# EAGLE design pure_battery (EAGLE 9.5.2)
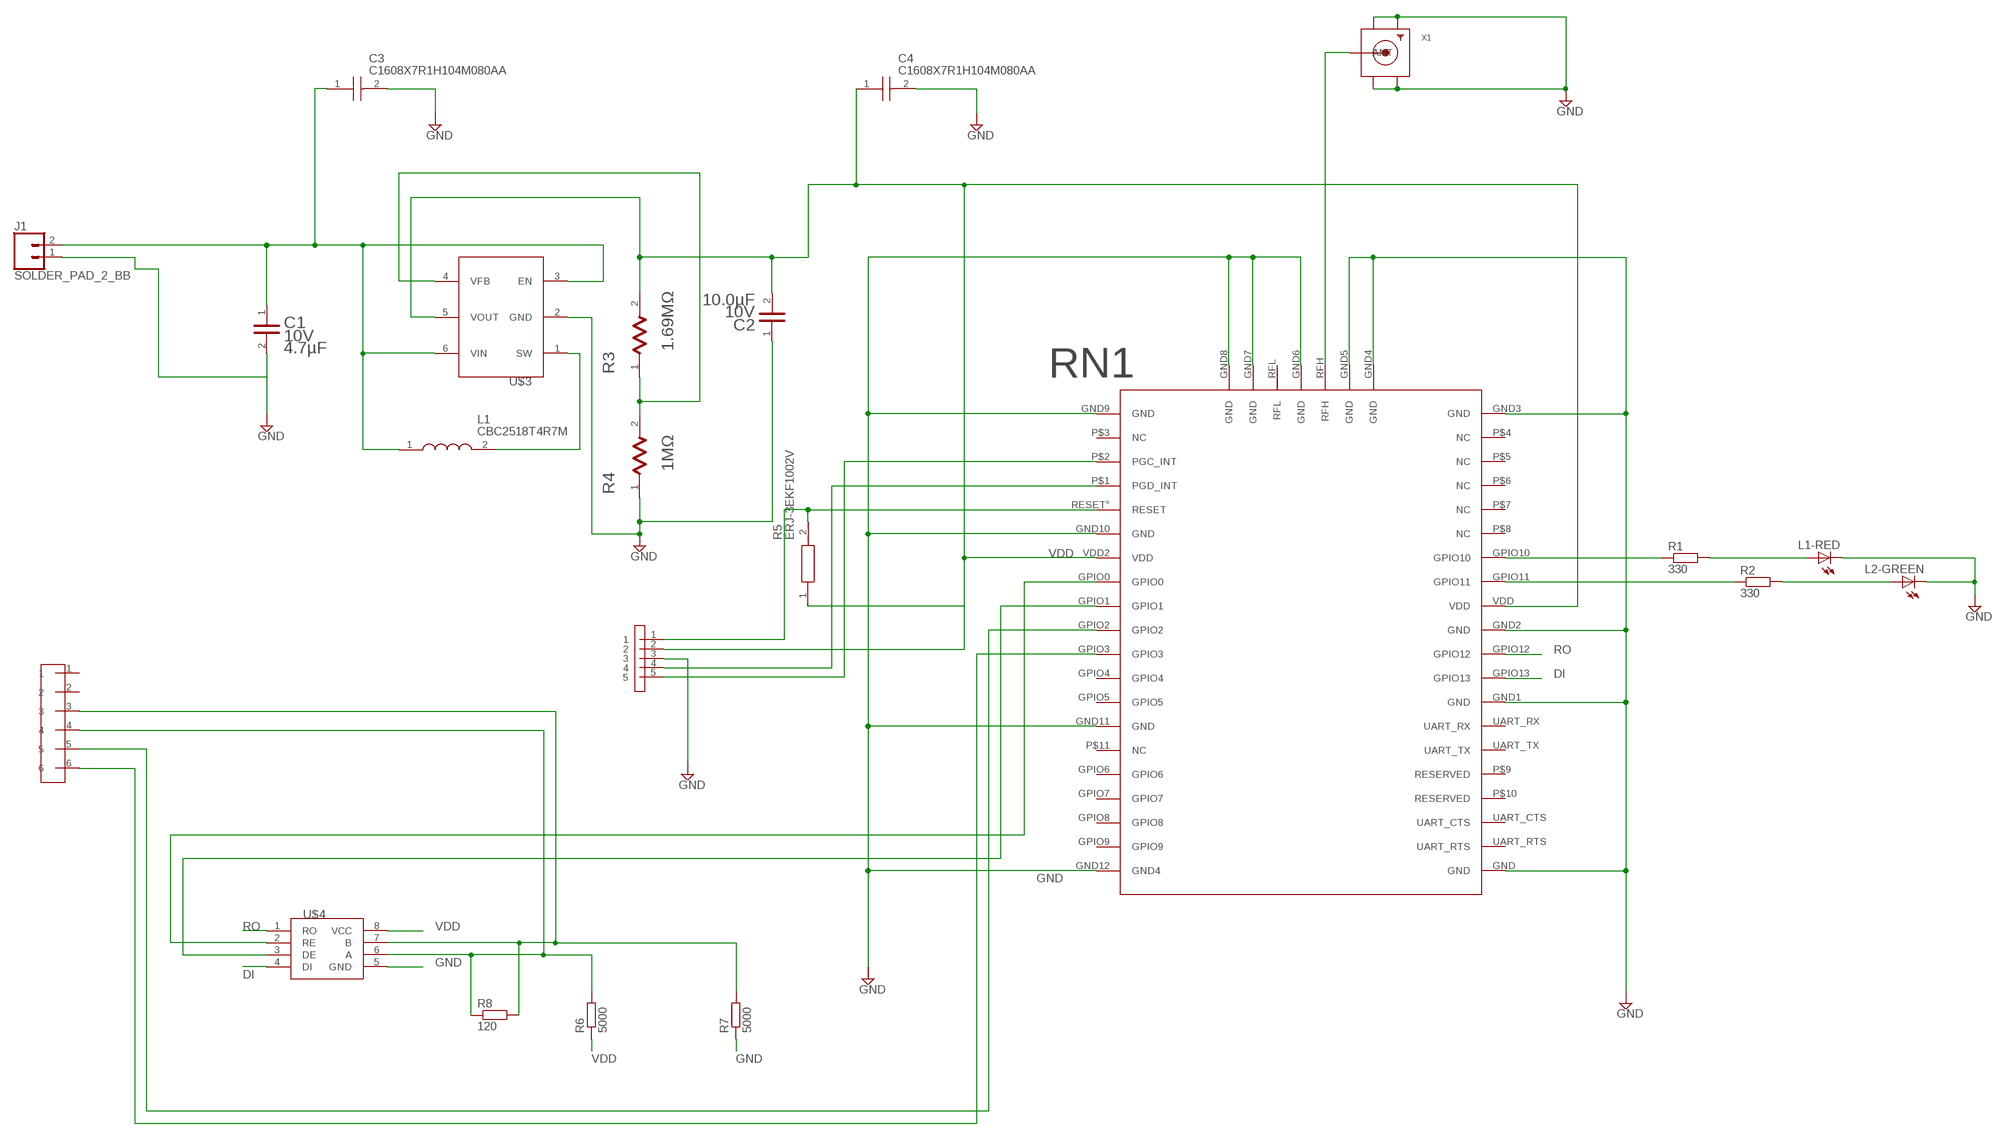
[diagram p0: schematic, sheet 1]

## Parts
C1  KEMET_C0603C475K8PACTUKEMET_C0603C475K8PACTU_0_0  [KEMET_C0603C475K8PACTU_0]
C2  TDK_C1608X5R1A106M080ACTDK_C1608X5R1A106M080AC_0_0  [TDK_C1608X5R1A106M080AC_0]
C3  C1608X7R1H104M080AA  [CAPC1608X80N]
C4  C1608X7R1H104M080AA  [CAPC1608X80N]
J1  SOLDER_PAD_2_BB  [SOLDER_PAD_2]
L1  CBC2518T4R7M  [INDC2518X200N]
L1-RED  LEDCHIP-LED0603  [CHIP-LED0603]
L2-GREEN  LEDCHIP-LED0603  [CHIP-LED0603]
R1  330  R-EU_R0603  [R0603]
R2  330  R-EU_R0603  [R0603]
R3  VISHAY_CRCW06031M69FKEAVISHAY_CRCW06031M69FKEA_0_1  [VISHAY_CRCW06031M69FKEA_1]
R4  STACKPOLE_RMCF0603FT1M00STACKPOLE_RMCF0603FT1M00_0_1  [STACKPOLE_RMCF0603FT1M00_1]
R5  ERJ-3EKF1002V  [RESC1608X55N]
R6  5000  R-EU_R0805  [R0805]
R7  5000  R-EU_R0805  [R0805]
R8  120  R-EU_R0805  [R0805]
RN1  NEW_RN2483  [NEW_RN2483]
U$1  CONNECTOR62  [CONNECTOR6]
U$2  ICSP52  [ICSP]
U$3  MCP16252  [MCP16252]
U$4  AMD3485E  [AMD3485E]
X1  SMACONNECTOR_EDGE  [SMA_EDGELAUNCH]

## Nets
DI: RN1.GPIO13 U$4.4(DI)
GND: C1.2 C2.1 C3.2 C4.2 J1.1 L1-RED.C L2-GREEN.C R4.1 R7.1 RN1.GND RN1.GND1(GND) RN1.GND2(GND) RN1.GND3(GND) RN1.GND4(GND) RN1.GND5(GND) RN1.GND6(GND) RN1.GND7(GND) RN1.GND8(GND) RN1.GND9(GND) RN1.GND10(GND) RN1.GND11(GND) RN1.GND12(GND4) U$2.3 U$3.2(GND) U$4.5(GND) X1.GND@1(GND4) X1.GND@2(GND3) X1.GND@3(GND2) X1.GND@4(GND1)
N$1: R1.1 RN1.GPIO10
N$2: L1-RED.A R1.2
N$3: C1.1 C3.1 J1.2 L1.1 U$3.3(EN) U$3.6(VIN)
N$4: R2.1 RN1.GPIO11
N$5: L2-GREEN.A R2.2
N$6: RN1.P$2(PGC_INT) U$2.5
N$7: L1.2 U$3.1(SW)
N$8: R3.1 R4.2 U$3.4(VFB)
N$9: RN1.P$1(PGD_INT) U$2.4
N$10: RN1.GPIO0 U$4.2(RE)
N$11: R5.2 RN1.RESET°(RESET) U$2.1
N$12: RN1.RFH X1.P(ANT)
N$13: R7.2 R8.2 U$1.3 U$4.7(B)
N$14: R6.2 R8.1 U$1.4 U$4.6(A)
N$15: RN1.GPIO1 U$4.3(DE)
N$16: RN1.GPIO2 U$1.5
N$17: RN1.GPIO3 U$1.6
RO: RN1.GPIO12 U$4.1(RO)
VDD: C2.2 C4.1 R3.2 R5.1 R6.1 RN1.VDD RN1.VDD2(VDD) U$2.2 U$3.5(VOUT) U$4.8(VCC)
Unconnected: RN1.GPIO4 RN1.GPIO5 RN1.GPIO6 RN1.GPIO7 RN1.GPIO8 RN1.GPIO9 RN1.P$3(NC) RN1.P$4(NC) RN1.P$5(NC) RN1.P$6(NC) RN1.P$7(NC) RN1.P$8(NC) RN1.P$9(RESERVED) RN1.P$10(RESERVED) RN1.P$11(NC) RN1.RFL RN1.UART_CTS RN1.UART_RTS RN1.UART_RX RN1.UART_TX U$1.1 U$1.2

## Library data of the parts
C1 = Kemet - C0603C475K8PACTU:KEMET_C0603C475K8PACTU: CAP CER 4.7UF 10V X5R 0603; CAPACITANCE: 4.7µF; CENTROID_NOT_SPECIFIED: No; DATASHEET: https://search.kemet.com/component-edge/download/datasheet/C0603C475K8PACTU.pdf; DIGIKEY_DESCRIPTION: CAP CER 4.7UF 10V X5R 0603; DIGIKEY_PART_NUMBER: 399-5503-1-ND; LEAD_FREE: yes; MF: Kemet; MFG_PACKAGE_IDENT: C0603; MOUSER_DESCRIPTION: Multilayer Ceramic Capacitors MLCC - SMD/SMT 10volts 4.7uF 10% X5R; MOUSER_PART_NUMBER: 80-C0603C475K8P; MPN: C0603C475K8PACTU; PACKAGE: 0603; PREFIX: C; ROHS: yes; TEMPERATURE_RANGE_HIGH: +85°C; TEMPERATURE_RANGE_LOW: -55°C; VOLTAGE: 10V
C2 = TDK - C1608X5R1A106M080AC:TDK_C1608X5R1A106M080AC: 10 uF Ceramic Capacitor; CAPACITANCE: 10.0µF; CAPACITANCE_TOLERANCE: ±20%; CENTROID_NOT_SPECIFIED: No; DATASHEET: https://product.tdk.com/info/en/catalog/datasheets/mlcc_commercial_general_en.pdf; DIELECTRIC_CHARACTERISTIC: X5R; DIELECTRIC_MATERIAL: Ceramic Multilayer; DIGIKEY_DESCRIPTION: CAP CER 10UF 10V X5R 0603; DIGIKEY_PART_NUMBER: 445-6853-1-ND; IMPORTED_FROM: octopart; IPC_LAND_PATTERN_NAME: CAPC16080X80; LEAD_FREE: yes; MF: TDK; MOUSER_PART_NUMBER: 810-C1608X5R1A106M; MPN: C1608X5R1A106M080AC; NUM_PINS: 2; OCTOPART_PART_NUMBER: f5f73d6e4e4d2a30; PACKAGE: 0603; PREFIX: C; ROHS: yes; SIZE_LENGTH: 1.6 mm; SIZE_THICKNESS: 800 um; SIZE_WIDTH: 800 um; TEMPERATURE_RANGE_HIGH: +85°C; TEMPERATURE_RANGE_LOW: -55°C; VOLTAGE: 10V; VOLTAGE_RATING_DC: 10 V
C3 C4 = C1608X7R1H104M080AA:C1608X7R1H104M080AA: TDK 0603 C 100nF Ceramic Multilayer Capacitor, 50 V dc, +125C, X7R Dielectric, +/-20% Source: Datasheet <https://product.tdk.com/info/en/catalog/datasheets/mlcc_commercial_midvoltage_en.pdf>; ARROW_PART_NUMBER: C1608X7R1H104M080AA; ARROW_PRICE-STOCK: https://www.arrow.com/en/products/c1608x7r1h104m080aa/tdk; DESCRIPTION: TDK 0603 C 100nF Ceramic Multilayer Capacitor, 50 V dc, +125C, X7R Dielectric, +/-20%; HEIGHT: 0.8mm; MANUFACTURER_NAME: TDK; MANUFACTURER_PART_NUMBER: C1608X7R1H104M080AA; MOUSER_PART_NUMBER: 810-C1608X7R1H104M; MOUSER_PRICE-STOCK: https://www.mouser.co.uk/ProductDetail/TDK/C1608X7R1H104M080AA?qs=dfay7wIA1uEL2BE%2FFUaTdg%3D%3D
J1 = SparkFun-Connectors:SOLDER_PAD_2_BB: Solder Pad for LuMini Rings
L1 = CBC2518T4R7M:CBC2518T4R7M: Fixed Inductors INDCTR HI CUR WND 1007 4.7uH 20% Source: Datasheet <http://ds.yuden.co.jp/TYCOMPAS/ut/detail.do?productNo=CBC2518T4R7M&dataUnit=M.pdf>; ARROW_PART_NUMBER: CBC2518T4R7M; DESCRIPTION: Fixed Inductors INDCTR HI CUR WND 1007 4.7uH 20%; HEIGHT: 2mm; MANUFACTURER_NAME: TAIYO YUDEN; MANUFACTURER_PART_NUMBER: CBC2518T4R7M; MOUSER_PART_NUMBER: 963-CBC2518T4R7M; MOUSER_PRICE-STOCK: https://www.mouser.com/Search/Refine.aspx?Keyword=963-CBC2518T4R7M
L1-RED L2-GREEN = adafruit:LED: LED OSRAM: - CHIPLED LG R971, LG N971, LY N971, LG Q971, LY Q971, LO R971, LY R971 LH N974, LH R974 LS Q976, LO Q976, LY Q976 LO Q996 - Hyper CHIPLED LW Q18S LB Q993, LB Q99A, LB R99A - SideLED LS A670, LO A670, LY A670, LG A670, LP A670 LB A673, LV A673, LT A673, LW A673 LH A674 LY A675 LS A676, LA A676, LO A676, LY A676, LW A676 LS A679, LY A679, LG A679 - Hyper Micro SIDELED® LS Y876, LA Y876, LO Y876, LY Y876 LT Y87S - SmartLED LW L88C, LW L88S LB L89C, LB L89S, LG L890 LS L89K, LO L89K, LY L89K LS L896, LA L896, LO L896, LY L896 - TOPLED LS T670, LO T670, LY T670, LG T670, LP T670 LSG T670, LSP T670, LSY T670, LOP T670, LYG T670 LG T671, LOG T671, LSG T671 LB T673, LV T673, LT T673, LW T673 LH T674 LS T676, LA T676, LO T676, LY T676, LB T676, LH T676, LSB T676, LW T676 LB T67C, LV T67C, LT T67C, LS T67K, LO T67K, LY T67K, LW E67C LS E67B, LA E67B, LO E67B, LY E67B, LB E67C, LV E67C, LT E67C LW T67C LS T679, LY T679, LG T679 LS T770, LO T770, LY T770, LG T770, LP T770 LB T773, LV T773, LT T773, LW T773 LH T774 LS E675, LA E675, LY E675, LS T675 LS T776, LA T776, LO T776, LY T776, LB T776 LHGB T686 LT T68C, LB T68C - Hyper Mini TOPLED® LB M676 - Mini TOPLED Santana® LG M470 LS M47K, LO M47K, LY M47K Source: http://www.osram.convergy.de/
R1 R2 R6-R8 = rcl:R-EU_: RESISTOR, European symbol; SPICEPREFIX: R
R3 = Vishay - CRCW06031M69FKEA:VISHAY_CRCW06031M69FKEA: RES Thick Film SMD 1.69MΩ 1% 1/10W 0603 100ppm/K; APPROVED_ALTERNATE_PART_NUMBER: 541-1.00HHCT-ND; CENTROID_NOT_SPECIFIED: No; COMPOSITION: Thick Film; DATASHEET: https://www.vishay.com/docs/20035/dcrcwe3.pdf; DEVICE_CLASS_L1: Passive Components; DEVICE_CLASS_L2: Resistors; DEVICE_CLASS_L3: Chip SMD Resistors; DIGIKEY_DESCRIPTION: RES SMD 1.69M OHM 1% 1/10W 0603; DIGIKEY_PART_NUMBER: 541-1.69MHTR-ND; FOOTPRINT_PARAMETERS_0: {"fp_type":"chip_res","params":{"L":{"nom":1550000,"long name":"Length","min":1500000,"max":1650000,"short name":"L","type":"measurement"},"W":{"nom":850000,"long name":"Width","min":750000,"max":950000,"short name":"W","type":"measurement"},"t":{"nom":450000,"long name":"Height","min":400000,"max":500000,"short name":"t","type":"measurement"},"b":{"nom":300000,"long name":"Terminal width","min":100000,"max":500000,"short name":"b","type":"measurement"},"P":{"default":"false","long name":"Polarized","type":"multichoice","short name":"P"},"offset x":{"nom":0,"long name":"X Center offset","min":null,"max":null,"short name":"offset x","type":"measurement"},"offset y":{"nom":0,"long name":"Y Center offset","min":null,"max":null,"short name":"offset y","type":"measurement"},"LS":{"long name":"Land shape","type":"fixed","short name":"LS","value":"Rectangle"},"solder toe":{"nom":550000,"long name":"Solder fillet (toe)","min":null,"max":null,"short name":"solder toe","type":"fixedmeasurement"},"solder heel":{"nom":-50000,"long name":"Solder fillet (heel)","min":null,"max":null,"short name":"solder heel","type":"fixedmeasurement"},"solder side":{"nom":50000,"long name":"Solder fillet (side)","min":null,"max":null,"short name":"solder side","type":"fixedmeasurement"},"courtyard":{"nom":500000,"long name":"Courtyard","min":null,"max":null,"short name":"courtyard","type":"fixedmeasurement"},"SF":{"default":"A (>= 1608 metric)","long name":"Packing level","type":"multichoiceparent","short name":"SF","help":"http://support.upverter.com/customer/portal/articles/978783-what-is-a-footprint-packing-level","children":["solder toe","solder heel","solder side","courtyard"]}}}; FOOTPRINT_PARAMETERS_1: {"fp_type":"chip_res","params":{"L":{"nom":1550000,"long name":"Length","min":1500000,"max":1650000,"short name":"L","type":"measurement"},"W":{"nom":850000,"long name":"Width","min":750000,"max":950000,"short name":"W","type":"measurement"},"t":{"nom":450000,"long name":"Height","min":400000,"max":500000,"short name":"t","type":"measurement"},"b":{"nom":300000,"long name":"Terminal width","min":100000,"max":500000,"short name":"b","type":"measurement"},"P":{"default":"false","long name":"Polarized","type":"multichoice","short name":"P"},"offset x":{"nom":0,"long name":"X Center offset","min":null,"max":null,"short name":"offset x","type":"measurement"},"offset y":{"nom":0,"long name":"Y Center offset","min":null,"max":null,"short name":"offset y","type":"measurement"},"LS":{"long name":"Land shape","type":"fixed","short name":"LS","value":"Rectangle"},"solder toe":{"nom":350000,"long name":"Solder fillet (toe)","min":null,"max":null,"short name":"solder toe","type":"fixedmeasurement"},"solder heel":{"nom":-50000,"long name":"Solder fillet (heel)","min":null,"max":null,"short name":"solder heel","type":"fixedmeasurement"},"solder side":{"nom":0,"long name":"Solder fillet (side)","min":null,"max":null,"short name":"solder side","type":"fixedmeasurement"},"courtyard":{"nom":250000,"long name":"Courtyard","min":null,"max":null,"short name":"courtyard","type":"fixedmeasurement"},"SF":{"default":"B (>= 1608 metric)","long name":"Packing level","type":"multichoiceparent","short name":"SF","help":"http://support.upverter.com/customer/portal/articles/978783-what-is-a-footprint-packing-level","children":["solder toe","solder heel","solder side","courtyard"]}}}; FOOTPRINT_PARAMETERS_2: {"fp_type":"chip_res","params":{"L":{"nom":1550000,"long name":"Length","min":1500000,"max":1650000,"short name":"L","type":"measurement"},"W":{"nom":850000,"long name":"Width","min":750000,"max":950000,"short name":"W","type":"measurement"},"t":{"nom":450000,"long name":"Height","min":400000,"max":500000,"short name":"t","type":"measurement"},"b":{"nom":300000,"long name":"Terminal width","min":100000,"max":500000,"short name":"b","type":"measurement"},"P":{"default":"false","long name":"Polarized","type":"multichoice","short name":"P"},"offset x":{"nom":0,"long name":"X Center offset","min":null,"max":null,"short name":"offset x","type":"measurement"},"offset y":{"nom":0,"long name":"Y Center offset","min":null,"max":null,"short name":"offset y","type":"measurement"},"LS":{"long name":"Land shape","type":"fixed","short name":"LS","value":"Rectangle"},"solder toe":{"nom":150000,"long name":"Solder fillet (toe)","min":null,"max":null,"short name":"solder toe","type":"fixedmeasurement"},"solder heel":{"nom":-50000,"long name":"Solder fillet (heel)","min":null,"max":null,"short name":"solder heel","type":"fixedmeasurement"},"solder side":{"nom":-50000,"long name":"Solder fillet (side)","min":null,"max":null,"short name":"solder side","type":"fixedmeasurement"},"courtyard":{"nom":100000,"long name":"Courtyard","min":null,"max":null,"short name":"courtyard","type":"fixedmeasurement"},"SF":{"default":"C (>= 1608 metric)","long name":"Packing level","type":"multichoiceparent","short name":"SF","help":"http://support.upverter.com/customer/portal/articles/978783-what-is-a-footprint-packing-level","children":["solder toe","solder heel","solder side","courtyard"]}}}; FOOTPRINT_VARIANT_NAME_0: IPC_A; FOOTPRINT_VARIANT_NAME_1: IPC_B; FOOTPRINT_VARIANT_NAME_2: IPC_C; FOOTPRINT_VARIANT_NAME_3: Recommended_Land_Pattern; HEIGHT: 0.5mm; IPC_LAND_PATTERN_NAME: RESC15585X45; LEAD_FREE: yes; MF: Vishay; MFG_PACKAGE_IDENT: CRCW0603; MFG_PACKAGE_IDENT_DATE: 0; MFG_PACKAGE_IDENT_REV: 0; MOUSER_DESCRIPTION: Thick Film Resistors - SMD 1/10watt 1.69Mohms 1%; MOUSER_PART_NUMBER: 71-CRCW06031M69FKEA; MPN: CRCW06031M69FKEA; PACKAGE: 0603 (1608 Metric); POWER: 100mW; POWER_RATING: 0.1W; PREFIX: R; RESISTANCE: 1.69MΩ; ROHS: yes; SERIES: CRCW; STANDOFF_HEIGHT: 0mm; TEMPERATURE_COEFFICIENT: 100ppm/K; TEMPERATURE_RANGE_HIGH: +155°C; TEMPERATURE_RANGE_LOW: -55°C; TOLERANCE: 1%; VERIFICATION_VERSION: 0.0.0.1; VOLTAGE: 75V; VOLTAGE_RATING: 75V
R4 = Stackpole - RMCF0603FT1M00:STACKPOLE_RMCF0603FT1M00: RES Thick Film SMD 1MΩ 1% 1/10W 0603 100ppm/°C; APPROVED_ALTERNATE_PART_NUMBER: 541-1.00HHCT-ND; CENTROID_NOT_SPECIFIED: No; COMPOSITION: Thick Film; DATASHEET: https://www.seielect.com/Catalog/SEI-RMCF_RMCP.pdf; DEVICE_CLASS_L1: Passive Components; DEVICE_CLASS_L2: Resistors; DEVICE_CLASS_L3: Chip SMD Resistors; DIGIKEY_DESCRIPTION: RES TF 1/10W 1M OHM 1% 0603; DIGIKEY_PART_NUMBER: RMCF0603FT1M00-ND; FOOTPRINT_PARAMETERS_0: {"fp_type":"chip_res","params":{"L":{"nom":1550000,"long name":"Length","min":1500000,"max":1650000,"short name":"L","type":"measurement"},"W":{"nom":850000,"long name":"Width","min":750000,"max":950000,"short name":"W","type":"measurement"},"t":{"nom":450000,"long name":"Height","min":400000,"max":500000,"short name":"t","type":"measurement"},"b":{"nom":300000,"long name":"Terminal width","min":100000,"max":500000,"short name":"b","type":"measurement"},"P":{"default":"false","long name":"Polarized","type":"multichoice","short name":"P"},"offset x":{"nom":0,"long name":"X Center offset","min":null,"max":null,"short name":"offset x","type":"measurement"},"offset y":{"nom":0,"long name":"Y Center offset","min":null,"max":null,"short name":"offset y","type":"measurement"},"LS":{"long name":"Land shape","type":"fixed","short name":"LS","value":"Rectangle"},"solder toe":{"nom":550000,"long name":"Solder fillet (toe)","min":null,"max":null,"short name":"solder toe","type":"fixedmeasurement"},"solder heel":{"nom":-50000,"long name":"Solder fillet (heel)","min":null,"max":null,"short name":"solder heel","type":"fixedmeasurement"},"solder side":{"nom":50000,"long name":"Solder fillet (side)","min":null,"max":null,"short name":"solder side","type":"fixedmeasurement"},"courtyard":{"nom":500000,"long name":"Courtyard","min":null,"max":null,"short name":"courtyard","type":"fixedmeasurement"},"SF":{"default":"A (>= 1608 metric)","long name":"Packing level","type":"multichoiceparent","short name":"SF","help":"http://support.upverter.com/customer/portal/articles/978783-what-is-a-footprint-packing-level","children":["solder toe","solder heel","solder side","courtyard"]}}}; FOOTPRINT_PARAMETERS_1: {"fp_type":"chip_res","params":{"L":{"nom":1550000,"long name":"Length","min":1500000,"max":1650000,"short name":"L","type":"measurement"},"W":{"nom":850000,"long name":"Width","min":750000,"max":950000,"short name":"W","type":"measurement"},"t":{"nom":450000,"long name":"Height","min":400000,"max":500000,"short name":"t","type":"measurement"},"b":{"nom":300000,"long name":"Terminal width","min":100000,"max":500000,"short name":"b","type":"measurement"},"P":{"default":"false","long name":"Polarized","type":"multichoice","short name":"P"},"offset x":{"nom":0,"long name":"X Center offset","min":null,"max":null,"short name":"offset x","type":"measurement"},"offset y":{"nom":0,"long name":"Y Center offset","min":null,"max":null,"short name":"offset y","type":"measurement"},"LS":{"long name":"Land shape","type":"fixed","short name":"LS","value":"Rectangle"},"solder toe":{"nom":350000,"long name":"Solder fillet (toe)","min":null,"max":null,"short name":"solder toe","type":"fixedmeasurement"},"solder heel":{"nom":-50000,"long name":"Solder fillet (heel)","min":null,"max":null,"short name":"solder heel","type":"fixedmeasurement"},"solder side":{"nom":0,"long name":"Solder fillet (side)","min":null,"max":null,"short name":"solder side","type":"fixedmeasurement"},"courtyard":{"nom":250000,"long name":"Courtyard","min":null,"max":null,"short name":"courtyard","type":"fixedmeasurement"},"SF":{"default":"B (>= 1608 metric)","long name":"Packing level","type":"multichoiceparent","short name":"SF","help":"http://support.upverter.com/customer/portal/articles/978783-what-is-a-footprint-packing-level","children":["solder toe","solder heel","solder side","courtyard"]}}}; FOOTPRINT_PARAMETERS_2: {"fp_type":"chip_res","params":{"L":{"nom":1550000,"long name":"Length","min":1500000,"max":1650000,"short name":"L","type":"measurement"},"W":{"nom":850000,"long name":"Width","min":750000,"max":950000,"short name":"W","type":"measurement"},"t":{"nom":450000,"long name":"Height","min":400000,"max":500000,"short name":"t","type":"measurement"},"b":{"nom":300000,"long name":"Terminal width","min":100000,"max":500000,"short name":"b","type":"measurement"},"P":{"default":"false","long name":"Polarized","type":"multichoice","short name":"P"},"offset x":{"nom":0,"long name":"X Center offset","min":null,"max":null,"short name":"offset x","type":"measurement"},"offset y":{"nom":0,"long name":"Y Center offset","min":null,"max":null,"short name":"offset y","type":"measurement"},"LS":{"long name":"Land shape","type":"fixed","short name":"LS","value":"Rectangle"},"solder toe":{"nom":150000,"long name":"Solder fillet (toe)","min":null,"max":null,"short name":"solder toe","type":"fixedmeasurement"},"solder heel":{"nom":-50000,"long name":"Solder fillet (heel)","min":null,"max":null,"short name":"solder heel","type":"fixedmeasurement"},"solder side":{"nom":-50000,"long name":"Solder fillet (side)","min":null,"max":null,"short name":"solder side","type":"fixedmeasurement"},"courtyard":{"nom":100000,"long name":"Courtyard","min":null,"max":null,"short name":"courtyard","type":"fixedmeasurement"},"SF":{"default":"C (>= 1608 metric)","long name":"Packing level","type":"multichoiceparent","short name":"SF","help":"http://support.upverter.com/customer/portal/articles/978783-what-is-a-footprint-packing-level","children":["solder toe","solder heel","solder side","courtyard"]}}}; FOOTPRINT_VARIANT_NAME_0: IPC_A; FOOTPRINT_VARIANT_NAME_1: IPC_B; FOOTPRINT_VARIANT_NAME_2: IPC_C; FOOTPRINT_VARIANT_NAME_3: Recommended_Land_Pattern; HEIGHT: 0.5mm; IPC_LAND_PATTERN_NAME: RESC15585X45; LEAD_FREE: yes; MF: Stackpole; MFG_PACKAGE_IDENT: RMCF0603; MFG_PACKAGE_IDENT_DATE: 0; MFG_PACKAGE_IDENT_REV: 0; MPN: RMCF0603FT1M00; PACKAGE: 0603 (1608 Metric); POWER: 100mW; POWER_RATING: 0.1W; PREFIX: R; RESISTANCE: 1MΩ; ROHS: yes; SERIES: RMCF; STANDOFF_HEIGHT: 0mm; TEMPERATURE_COEFFICIENT: 100ppm/°C; TEMPERATURE_RANGE_HIGH: +155°C; TEMPERATURE_RANGE_LOW: -55°C; TOLERANCE: 1%; VERIFICATION_VERSION: 0.0.0.1; VOLTAGE: 75V; VOLTAGE_RATING: 75V
R5 = ERJ-3EKF1002V:ERJ-3EKF1002V: Thick Film Resistors - SMD 0603 10Kohms 1% AEC-Q200 Source: Datasheet <http://industrial.panasonic.com/cdbs/www-data/pdf/RDA0000/AOA0000C86.pdf>; ARROW_PART_NUMBER: ERJ-3EKF1002V; ARROW_PRICE-STOCK: https://www.arrow.com/en/products/erj-3ekf1002v/panasonic; DESCRIPTION: Thick Film Resistors - SMD 0603 10Kohms 1% AEC-Q200; HEIGHT: 0.55mm; MANUFACTURER_NAME: Panasonic; MANUFACTURER_PART_NUMBER: ERJ-3EKF1002V; MOUSER_PART_NUMBER: 667-ERJ-3EKF1002V; MOUSER_PRICE-STOCK: https://www.mouser.co.uk/ProductDetail/Panasonic/ERJ-3EKF1002V?qs=H7k1u0Mp9JSrGPQ5%2F5COuw%3D%3D
RN1 = tobias:NEW_RN2483
U$1 = conn4:CONNECTOR62
U$2 = conn4:ICSP52
U$3 = my_library:MCP16252
U$4 = AMD3485E:AMD3485E
X1 = adafruit:SMACONNECTOR: SMA Connector 90° DIP SMA Connector, 50 Ohm (4UConnector: 07259)

## Board
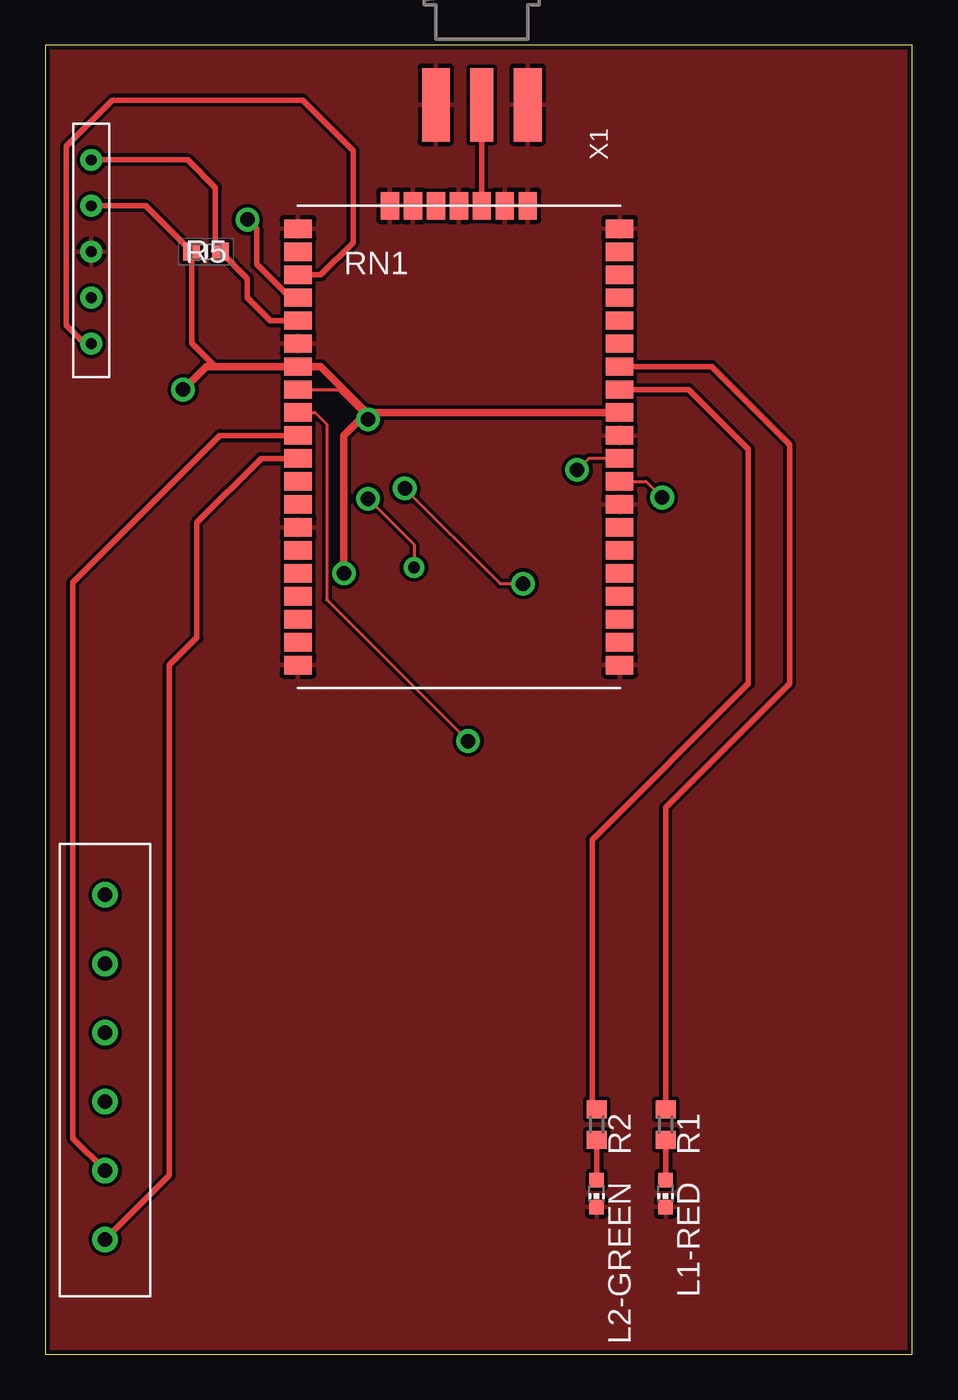
[diagram p1: board, top side]
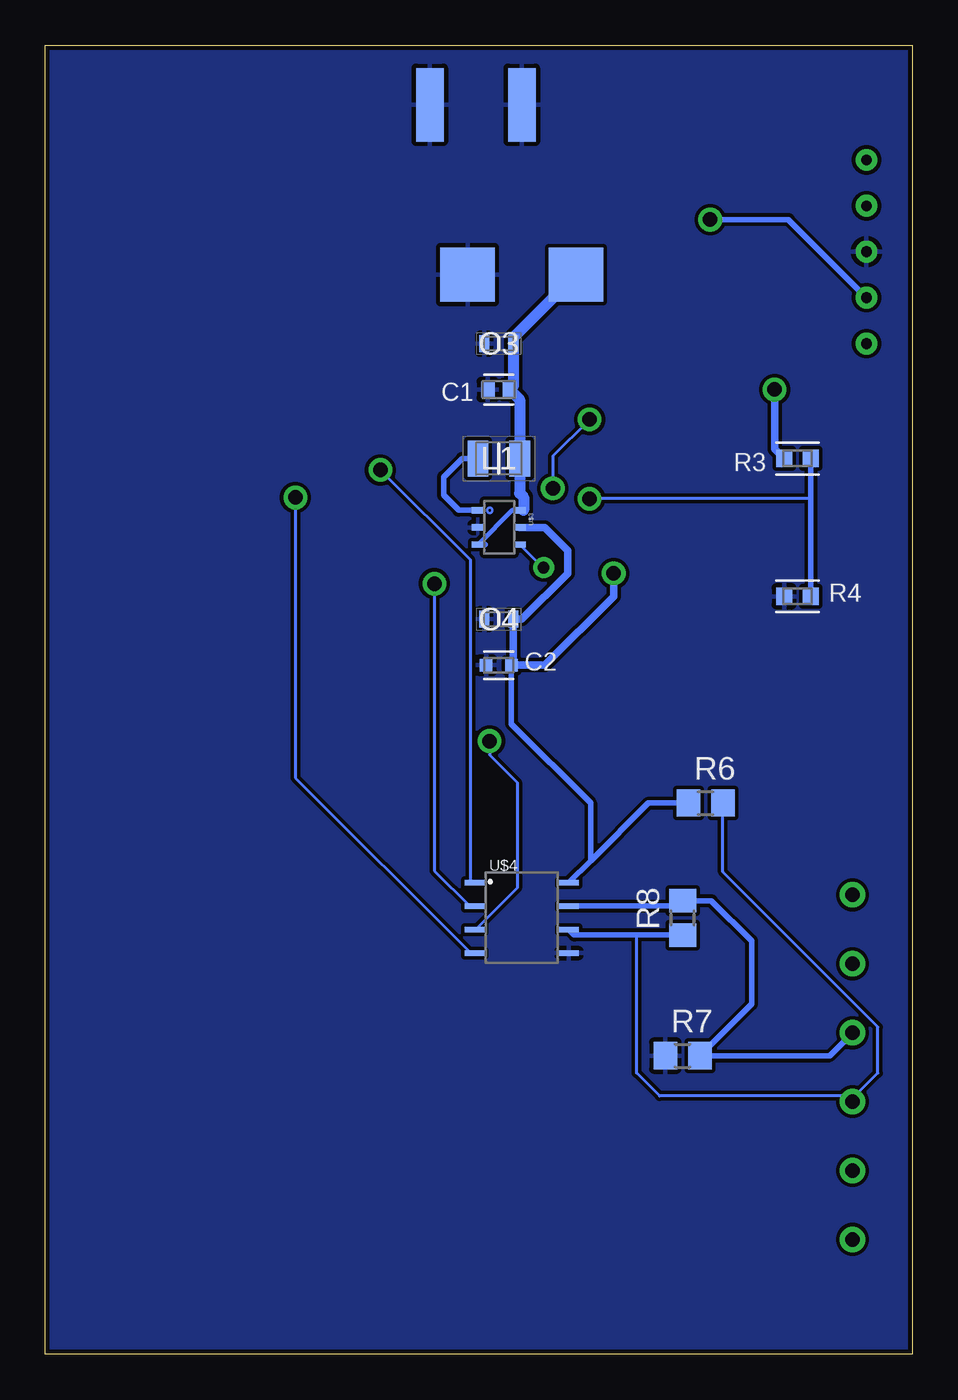
[diagram p2: board, bottom side, seen from below]

Size 47.93 x 72.38 mm. Coordinates in mm from the lower left corner, seen from the top.
Outline: 0,0 47.93,0 47.93,72.38 0,72.38 0,0
Copper layers (1*16): Top 0.035mm / dielectric 1.5mm / Bottom 0.035mm
Design rules "SparkFun": minimum track width 8mil, minimum drill 20mil, track to track 8mil, track to pad 8mil, pad to pad 8mil, via to via 8mil, smd to smd 8mil, copper to edge 10mil, drill to drill 8mil, minimum pad ring 12mil, minimum via ring 10mil, stop-mask expansion 4mil, vias tented up to drill 25mil, thermal gap 10mil

### Footprints (pad centres in the part's own frame; a part is rotated, then mirrored left to right if it is on the bottom)
KEMET_C0603C475K8PACTU_0 = smd 0.75 x 0.9: 1 -0.6,0; 2 0.6,0
TDK_C1608X5R1A106M080AC_0 = smd 0.7 x 0.7: 1 -0.7,0; 2 0.7,0
CAPC1608X80N = smd 0.54 x 0.94: 1 -0.8,0; 2 0.8,0
SOLDER_PAD_2 = smd 3 x 3: 1 -3,0; 2 3,0
INDC2518X200N = smd 1.15 x 2: 1 -1.15,0; 2 1.15,0
CHIP-LED0603 = smd 0.8 x 0.8: A 0,-0.75; C 0,0.75
R0603 = smd 1 x 1.1: 1 -0.85,0; 2 0.85,0
VISHAY_CRCW06031M69FKEA_1 = smd 0.891 x 0.962: 1 -0.737,0; 2 0.737,0
STACKPOLE_RMCF0603FT1M00_1 = smd 0.891 x 0.962: 1 -0.737,0; 2 0.737,0
RESC1608X55N = smd 0.9 x 1: 1 -0.8,0; 2 0.8,0
R0805 = smd 1.3 x 1.5: 1 -0.95,0; 2 0.95,0
NEW_RN2483 = smd 1.524 x 1.016: GND 17.78,1.27; GND1 17.78,10.16; GND2 17.78,13.97; GND3 17.78,25.4; GND9 0,25.4; GND10 0,19.05; GND11 0,8.89; GND12 0,1.27; GPIO0 0,16.51; GPIO1 0,15.24; GPIO2 0,13.97; GPIO3 0,12.7; GPIO4 0,11.43; GPIO5 0,10.16; GPIO6 0,6.35; GPIO7 0,5.08; GPIO8 0,3.81; GPIO9 0,2.54; GPIO10 17.78,17.78; GPIO11 17.78,16.51; GPIO12 17.78,12.7; GPIO13 17.78,11.43; P$1 0,21.59; P$2 0,22.86; P$3 0,24.13; P$4 17.78,24.13; P$5 17.78,22.86; P$6 17.78,21.59; P$7 17.78,20.32; P$8 17.78,19.05; P$9 17.78,6.35; P$10 17.78,5.08; P$11 0,7.62; RESET° 0,20.32; UART_CTS 17.78,3.81; UART_RTS 17.78,2.54; UART_RX 17.78,8.89; UART_TX 17.78,7.62; VDD 17.78,15.24; VDD2 0,17.78 | smd 1.016 x 1.524: GND4 12.7,26.67; GND5 11.43,26.67; GND6 8.89,26.67; GND7 6.35,26.67; GND8 5.08,26.67; RFH 10.16,26.67; RFL 7.62,26.67
CONNECTOR6 = drill 0.8: 1 -0.5,-3.81; 2 -0.5,-7.62; 3 -0.5,-11.43; 4 -0.5,-15.24; 5 -0.5,-19.05; 6 -0.5,-22.86
ICSP = drill 0.6: 1 -0.002,-0.002; 2 -0.002,-2.542; 3 -0.002,-5.082; 4 -0.002,-7.622; 5 -0.002,-10.162
MCP16252 = smd 0.35 x 0.675: 1 -0.95,-1.15; 2 0,-1.15; 3 0.95,-1.15; 4 0.95,1.15; 5 0,1.15; 6 -0.95,1.15
AMD3485E = smd 1.1 x 0.3: 1 -2.6,1.95; 2 -2.6,0.65; 3 -2.6,-0.65; 4 -2.6,-1.95; 5 2.6,-1.95; 6 2.6,-0.65; 7 2.6,0.65; 8 2.6,1.95
SMA_EDGELAUNCH = smd 4.064 x 1.524: GND@1 2.032,-2.54; GND@2 2.032,2.54 | smd 4.064 x 1.524 bottom: GND@3 2.032,2.54; GND@4 2.032,-2.54 | smd 4.064 x 1.27: P 2.032,0

### Placement (x,y rotation side)
C1  22.86,53.34 180 bottom
C2  22.86,38.1 0 bottom
C3  22.86,55.88 180 bottom
C4  22.86,40.64 180 bottom
J1  21.59,59.69 0 bottom
L1  22.86,49.53 180 bottom
L1-RED  34.29,8.89 180 top
L2-GREEN  30.48,8.89 180 top
R1  34.29,12.7 270 top
R2  30.48,12.7 270 top
R3  6.35,49.53 180 bottom
R4  6.35,41.91 0 bottom
R5  8.89,60.96 0 top
R6  11.43,30.48 0 bottom
R7  12.7,16.51 0 bottom
R8  12.7,24.13 90 bottom
RN1  13.97,36.83 0 top
U$1  3.81,29.21 0 top
U$2  2.54,66.04 0 top
U$3  22.86,45.72 270 bottom
U$4  21.59,24.13 0 bottom
X1  24.13,71.12 270 top

### Tracks (layer width: path | path; a pad name or v marks a point on that pad's centre or on a via)
DI  (via drill 0.8)
  Top 0.152: v34.1,47.37 33.21,48.26 RN1.GPIO13
  Bottom 0.152: v34.1,47.37 34.1,31.88 24.45,22.22 U$4.4
GND
  pour Bottom: -3.81,80.01 54.61,80.01 57.15,77.47 57.15,-3.81 50.8,-10.16 -5.08,-10.16 -10.16,-5.08 -10.16,73.66
  pour Top: -3.81,76.2 50.8,76.2 50.8,0 45.72,-5.08 -3.81,-5.08
N$1
  Top 0.305: R1.1 34.29,30.23 41.15,37.08 41.15,50.29 36.83,54.61 RN1.GPIO10
N$2
  Top 0.305: R1.2 L1-RED.A
N$3
  Bottom 0.152: U$3.6 21.59,46.67 21.49,46.67
  Bottom 0.254: U$3.3 22.11,46.67 U$3.6
  Bottom 0.305: 23.61,44.77 U$3.3
  Bottom 0.61: J1.2 22.06,56.22 C3.1 22.06,53.54 C1.1 21.71,52.79 L1.1 21.71,47.61 21.49,47.39 21.49,46.67
N$4
  Top 0.305: RN1.GPIO11 35.56,53.34 38.86,50.04 38.86,37.08 30.23,28.45 30.23,13.8 R2.1
N$5
  Top 0.305: R2.2 L2-GREEN.A
N$6
  Top 0.305: RN1.P$2 15.24,59.69 17.02,61.47 17.02,66.55 14.22,69.34 3.71,69.34 1.17,66.8 1.17,56.9 2.19,55.88 U$2.5
N$7
  Bottom 0.305: 24.03,49.51 L1.2 24.89,49.53 25.91,48.51 25.91,47.5 25.08,46.67 U$3.1
N$8  (via drill 0.65, 0.8)
  Top 0.152: v20.38,43.5 20.38,44.77 v17.84,47.31
  Bottom 0.152: U$3.4 20.44,43.5 v20.38,43.5 | 5.61,47.31 v17.84,47.31
  Bottom 0.305: R3.1 5.61,47.31 R4.2
N$9  (via drill 0.8)
  Top 0.305: v11.18,62.74 11.68,62.23 11.68,60.27 13.54,58.42 RN1.P$1
  Bottom 0.305: U$2.4 6.86,62.74 v11.18,62.74
N$10  (via drill 0.8)
  Top 0.152: v19.88,47.88 25.15,42.61 v26.42,42.61 | v17.84,51.69 16.19,53.34 RN1.GPIO0
  Bottom 0.152: v26.42,42.61 26.42,26.73 24.45,24.76 U$4.2 | v17.84,51.69 19.88,49.66 v19.88,47.88
N$11
  Top 0.305: U$2.1 7.88,66.04 9.4,64.52 9.4,61.25 R5.2 11.18,59.47 11.18,58.42 12.45,57.15 RN1.RESET°
N$12
  Top 0.305: RN1.RFH X1.P
N$13
  Bottom 0.305: U$4.7 13,24.78 R8.2 11.11,25.08 8.89,22.86 8.89,19.37 R7.2 4.58,16.51 U$1.3
N$14
  Bottom 0.152: 3.17,14.29 3.49,13.97 U$1.4 3.17,14.29 | 3.17,14.29 1.91,15.56 1.91,18.1 10.48,26.67 R6.2 | 15.24,23.18 15.24,15.56 13.97,14.29 3.17,14.29
  Bottom 0.305: R8.1 15.24,23.18 18.69,23.18 U$4.6
N$15  (via drill 0.8)
  Top 0.152: v23.37,33.91 15.56,41.72 15.56,51.44 14.92,52.07 RN1.GPIO1
  Bottom 0.152: v23.37,33.91 23.37,33.15 21.84,31.62 21.84,25.78 24.13,23.49 U$4.3
N$16
  Top 0.305: U$1.5 1.52,11.95 1.52,42.67 9.65,50.8 RN1.GPIO2
N$17
  Top 0.305: U$1.6 6.86,9.9 6.86,38.1 8.38,39.62 8.38,45.97 11.94,49.53 RN1.GPIO3
RO  (via drill 0.8)
  Top 0.152: v29.4,48.9 30.04,49.53 RN1.GPIO12
  Bottom 0.152: v29.4,48.9 24.45,43.94 24.45,26.04 U$4.1
VDD  (via drill 0.8)
  Top 0.305: 9.4,54.61 8.09,55.92 R5.1 5.55,63.5 U$2.2
  Top 0.406: 17.78,52.07 15.24,54.61 RN1.VDD2 9.4,54.61 8.89,54.61 v7.62,53.34 | RN1.VDD 17.78,52.07 | v16.51,43.18 16.51,50.8 17.78,52.07
  Bottom 0.305: C2.2 22.16,34.86 17.78,30.48 17.78,27.29 | U$4.8 17.78,27.29 | 17.78,27.29 14.59,30.48 R6.1
  Bottom 0.406: U$3.5 20.32,45.72 19.05,44.45 19.05,43.18 21.59,40.64 C4.1 22.06,38.2 C2.2 20.32,38.1 16.51,41.91 v16.51,43.18 | v7.62,53.34 7.62,50.06 R3.2